# Altium schematic sheet DUT Connect Wiring.SchDoc
size A3; DocumentNumber: 5; SheetNumber: 5; SheetTotal: 5; SheetSize: A3; CheckedByDate: 2022-412-415; DrawByDate: 2022-412-415; SiteName: ESG TD Huangpu
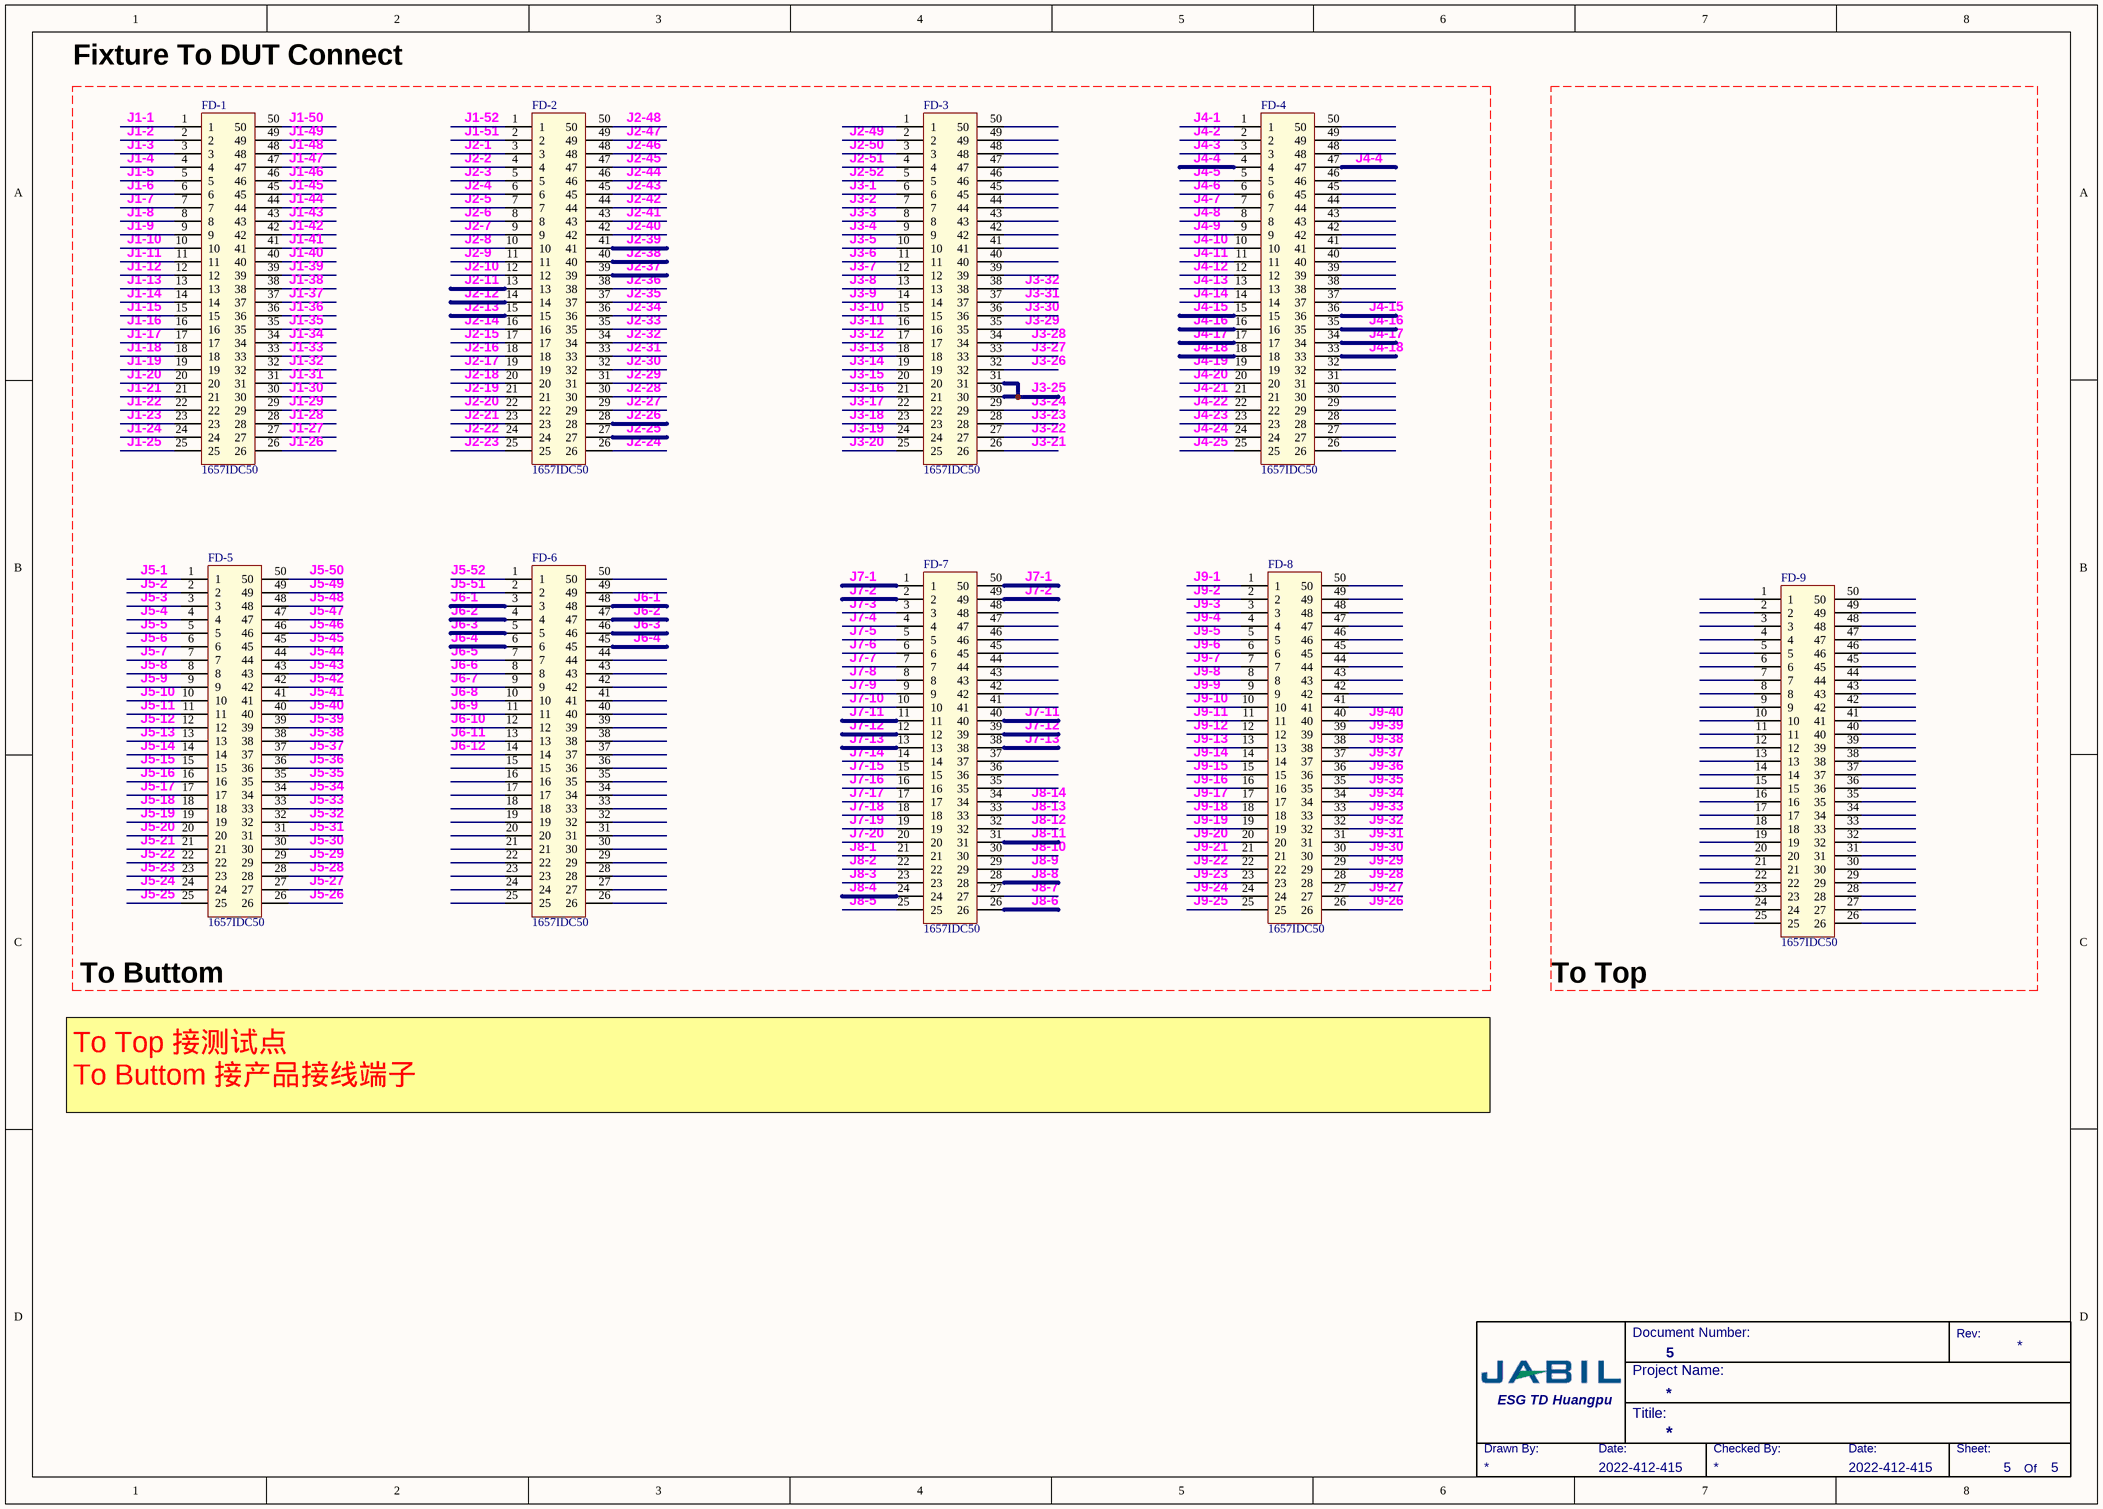
[diagram p0: DUT Connect Wiring.SchDoc]

## Parts
FD-1  1657IDC50
FD-2  1657IDC50
FD-3  1657IDC50
FD-4  1657IDC50
FD-5  1657IDC50
FD-6  1657IDC50
FD-7  1657IDC50
FD-8  1657IDC50
FD-9  1657IDC50

## Nets
J1-1: FD-1.1
J1-2: FD-1.2
J1-3: FD-1.3
J1-4: FD-1.4
J1-5: FD-1.5
J1-6: FD-1.6
J1-7: FD-1.7
J1-8: FD-1.8
J1-9: FD-1.9
J1-10: FD-1.10
J1-11: FD-1.11
J1-12: FD-1.12
J1-13: FD-1.13
J1-14: FD-1.14
J1-15: FD-1.15
J1-16: FD-1.16
J1-17: FD-1.17
J1-18: FD-1.18
J1-19: FD-1.19
J1-20: FD-1.20
J1-21: FD-1.21
J1-22: FD-1.22
J1-23: FD-1.23
J1-24: FD-1.24
J1-25: FD-1.25
J1-26: FD-1.26
J1-27: FD-1.27
J1-28: FD-1.28
J1-29: FD-1.29
J1-30: FD-1.30
J1-31: FD-1.31
J1-32: FD-1.32
J1-33: FD-1.33
J1-34: FD-1.34
J1-35: FD-1.35
J1-36: FD-1.36
J1-37: FD-1.37
J1-38: FD-1.38
J1-39: FD-1.39
J1-40: FD-1.40
J1-41: FD-1.41
J1-42: FD-1.42
J1-43: FD-1.43
J1-44: FD-1.44
J1-45: FD-1.45
J1-46: FD-1.46
J1-47: FD-1.47
J1-48: FD-1.48
J1-49: FD-1.49
J1-50: FD-1.50
J1-51: FD-2.2
J1-52: FD-2.1
J2-1: FD-2.3
J2-2: FD-2.4
J2-3: FD-2.5
J2-4: FD-2.6
J2-5: FD-2.7
J2-6: FD-2.8
J2-7: FD-2.9
J2-8: FD-2.10
J2-9: FD-2.11
J2-10: FD-2.12
J2-11: FD-2.13
J2-12: FD-2.14
J2-13: FD-2.15
J2-14: FD-2.16
J2-15: FD-2.17
J2-16: FD-2.18
J2-17: FD-2.19
J2-18: FD-2.20
J2-19: FD-2.21
J2-20: FD-2.22
J2-21: FD-2.23
J2-22: FD-2.24
J2-23: FD-2.25
J2-24: FD-2.26
J2-25: FD-2.27
J2-26: FD-2.28
J2-27: FD-2.29
J2-28: FD-2.30
J2-29: FD-2.31
J2-30: FD-2.32
J2-31: FD-2.33
J2-32: FD-2.34
J2-33: FD-2.35
J2-34: FD-2.36
J2-35: FD-2.37
J2-36: FD-2.38
J2-37: FD-2.39
J2-38: FD-2.40
J2-39: FD-2.41
J2-40: FD-2.42
J2-41: FD-2.43
J2-42: FD-2.44
J2-43: FD-2.45
J2-44: FD-2.46
J2-45: FD-2.47
J2-46: FD-2.48
J2-47: FD-2.49
J2-48: FD-2.50
J2-49: FD-3.2
J2-50: FD-3.3
J2-51: FD-3.4
J2-52: FD-3.5
J3-1: FD-3.6
J3-2: FD-3.7
J3-3: FD-3.8
J3-4: FD-3.9
J3-5: FD-3.10
J3-6: FD-3.11
J3-7: FD-3.12
J3-8: FD-3.13
J3-9: FD-3.14
J3-10: FD-3.15
J3-11: FD-3.16
J3-12: FD-3.17
J3-13: FD-3.18
J3-14: FD-3.19
J3-15: FD-3.20
J3-16: FD-3.21
J3-17: FD-3.22
J3-18: FD-3.23
J3-19: FD-3.24
J3-20: FD-3.25
J3-21: FD-3.26
J3-22: FD-3.27
J3-23: FD-3.28
J3-24: FD-3.29
J3-25: FD-3.30 FD-3.31
J3-26: FD-3.32
J3-27: FD-3.33
J3-28: FD-3.34
J3-29: FD-3.35
J3-30: FD-3.36
J3-31: FD-3.37
J3-32: FD-3.38
J4-1: FD-4.1
J4-2: FD-4.2
J4-3: FD-4.3
J4-4: FD-4.4 FD-4.47
J4-5: FD-4.5
J4-6: FD-4.6
J4-7: FD-4.7
J4-8: FD-4.8
J4-9: FD-4.9
J4-10: FD-4.10
J4-11: FD-4.11
J4-12: FD-4.12
J4-13: FD-4.13
J4-14: FD-4.14
J4-15: FD-4.15 FD-4.36
J4-16: FD-4.16 FD-4.35
J4-17: FD-4.17 FD-4.34
J4-18: FD-4.18 FD-4.33
J4-19: FD-4.19
J4-20: FD-4.20
J4-21: FD-4.21
J4-22: FD-4.22
J4-23: FD-4.23
J4-24: FD-4.24
J4-25: FD-4.25
J5-1: FD-5.1
J5-2: FD-5.2
J5-3: FD-5.3
J5-4: FD-5.4
J5-5: FD-5.5
J5-6: FD-5.6
J5-7: FD-5.7
J5-8: FD-5.8
J5-9: FD-5.9
J5-10: FD-5.10
J5-11: FD-5.11
J5-12: FD-5.12
J5-13: FD-5.13
J5-14: FD-5.14
J5-15: FD-5.15
J5-16: FD-5.16
J5-17: FD-5.17
J5-18: FD-5.18
J5-19: FD-5.19
J5-20: FD-5.20
J5-21: FD-5.21
J5-22: FD-5.22
J5-23: FD-5.23
J5-24: FD-5.24
J5-25: FD-5.25
J5-26: FD-5.26
J5-27: FD-5.27
J5-28: FD-5.28
J5-29: FD-5.29
J5-30: FD-5.30
J5-31: FD-5.31
J5-32: FD-5.32
J5-33: FD-5.33
J5-34: FD-5.34
J5-35: FD-5.35
J5-36: FD-5.36
J5-37: FD-5.37
J5-38: FD-5.38
J5-39: FD-5.39
J5-40: FD-5.40
J5-41: FD-5.41
J5-42: FD-5.42
J5-43: FD-5.43
J5-44: FD-5.44
J5-45: FD-5.45
J5-46: FD-5.46
J5-47: FD-5.47
J5-48: FD-5.48
J5-49: FD-5.49
J5-50: FD-5.50
J5-51: FD-6.2
J5-52: FD-6.1
J6-1: FD-6.3 FD-6.48
J6-2: FD-6.4 FD-6.47
J6-3: FD-6.5 FD-6.46
J6-4: FD-6.6 FD-6.45
J6-5: FD-6.7
J6-6: FD-6.8
J6-7: FD-6.9
J6-8: FD-6.10
J6-9: FD-6.11
J6-10: FD-6.12
J6-11: FD-6.13
J6-12: FD-6.14
J7-1: FD-7.1 FD-7.50
J7-2: FD-7.2 FD-7.49
J7-3: FD-7.3
J7-4: FD-7.4
J7-5: FD-7.5
J7-6: FD-7.6
J7-7: FD-7.7
J7-8: FD-7.8
J7-9: FD-7.9
J7-10: FD-7.10
J7-11: FD-7.11 FD-7.40
J7-12: FD-7.12 FD-7.39
J7-13: FD-7.13 FD-7.38
J7-14: FD-7.14
J7-15: FD-7.15
J7-16: FD-7.16
J7-17: FD-7.17
J7-18: FD-7.18
J7-19: FD-7.19
J7-20: FD-7.20
J8-1: FD-7.21
J8-2: FD-7.22
J8-3: FD-7.23
J8-4: FD-7.24
J8-5: FD-7.25
J8-6: FD-7.26
J8-7: FD-7.27
J8-8: FD-7.28
J8-9: FD-7.29
J8-10: FD-7.30
J8-11: FD-7.31
J8-12: FD-7.32
J8-13: FD-7.33
J8-14: FD-7.34
J9-1: FD-8.1
J9-2: FD-8.2
J9-3: FD-8.3
J9-4: FD-8.4
J9-5: FD-8.5
J9-6: FD-8.6
J9-7: FD-8.7
J9-8: FD-8.8
J9-9: FD-8.9
J9-10: FD-8.10
J9-11: FD-8.11
J9-12: FD-8.12
J9-13: FD-8.13
J9-14: FD-8.14
J9-15: FD-8.15
J9-16: FD-8.16
J9-17: FD-8.17
J9-18: FD-8.18
J9-19: FD-8.19
J9-20: FD-8.20
J9-21: FD-8.21
J9-22: FD-8.22
J9-23: FD-8.23
J9-24: FD-8.24
J9-25: FD-8.25
J9-26: FD-8.26
J9-27: FD-8.27
J9-28: FD-8.28
J9-29: FD-8.29
J9-30: FD-8.30
J9-31: FD-8.31
J9-32: FD-8.32
J9-33: FD-8.33
J9-34: FD-8.34
J9-35: FD-8.35
J9-36: FD-8.36
J9-37: FD-8.37
J9-38: FD-8.38
J9-39: FD-8.39
J9-40: FD-8.40

Not connected (* = marked no-connect by the designer): FD-3 1 39 40 41 42 43 44 45 46 47 48 49 50; FD-4 26 27 28 29 30 31 32 37 38 39 40 41 42 43 44 45 46 48 49 50; FD-6 15 16 17 18 19 20 21 22 23 24 25 26 27 28 29 30 31 32 33 34 35 36 37 38 39 40 41 42 43 44 49 50; FD-7 35 36 37 41 42 43 44 45 46 47 48; FD-8 41 42 43 44 45 46 47 48 49 50; FD-9 1 2 3 4 5 6 7 8 9 10 11 12 13 14 15 16 17 18 19 20 21 22 23 24 25 26 27 28 29 30 31 32 33 34 35 36 37 38 39 40 41 42 43 44 45 46 47 48 49 50

## Notes on the sheet
- Fixture To DUT Connect
- To Buttom
- To Top
- To Top 接测试点
  To Buttom 接产品接线端子
- Document Number:
- Project Name:
- Rev:
- Drawn By:
- Date:
- Titile:
- Checked By:
- Sheet:
- Of